# Altium schematic sheet LoraSTM32.SchDoc
size 420 x 297 mm; Scale: 1:1; Разраб.: Иванов; Обозначение документа: АБВГ.123456.001 Э3; Пров.: Петров; Утв.: Сидоров; Наименование организации: ОАО "Ваша фирма"; Перв. применение: АБВГ.123456.000; Наименование изделия 1: Плата; Наименование изделия 2: Схема электрическая; Наименование изделия 3: принципиальная; Нач. отд.: Нач. отд.; Фамилия нач. отд.: Сидоров
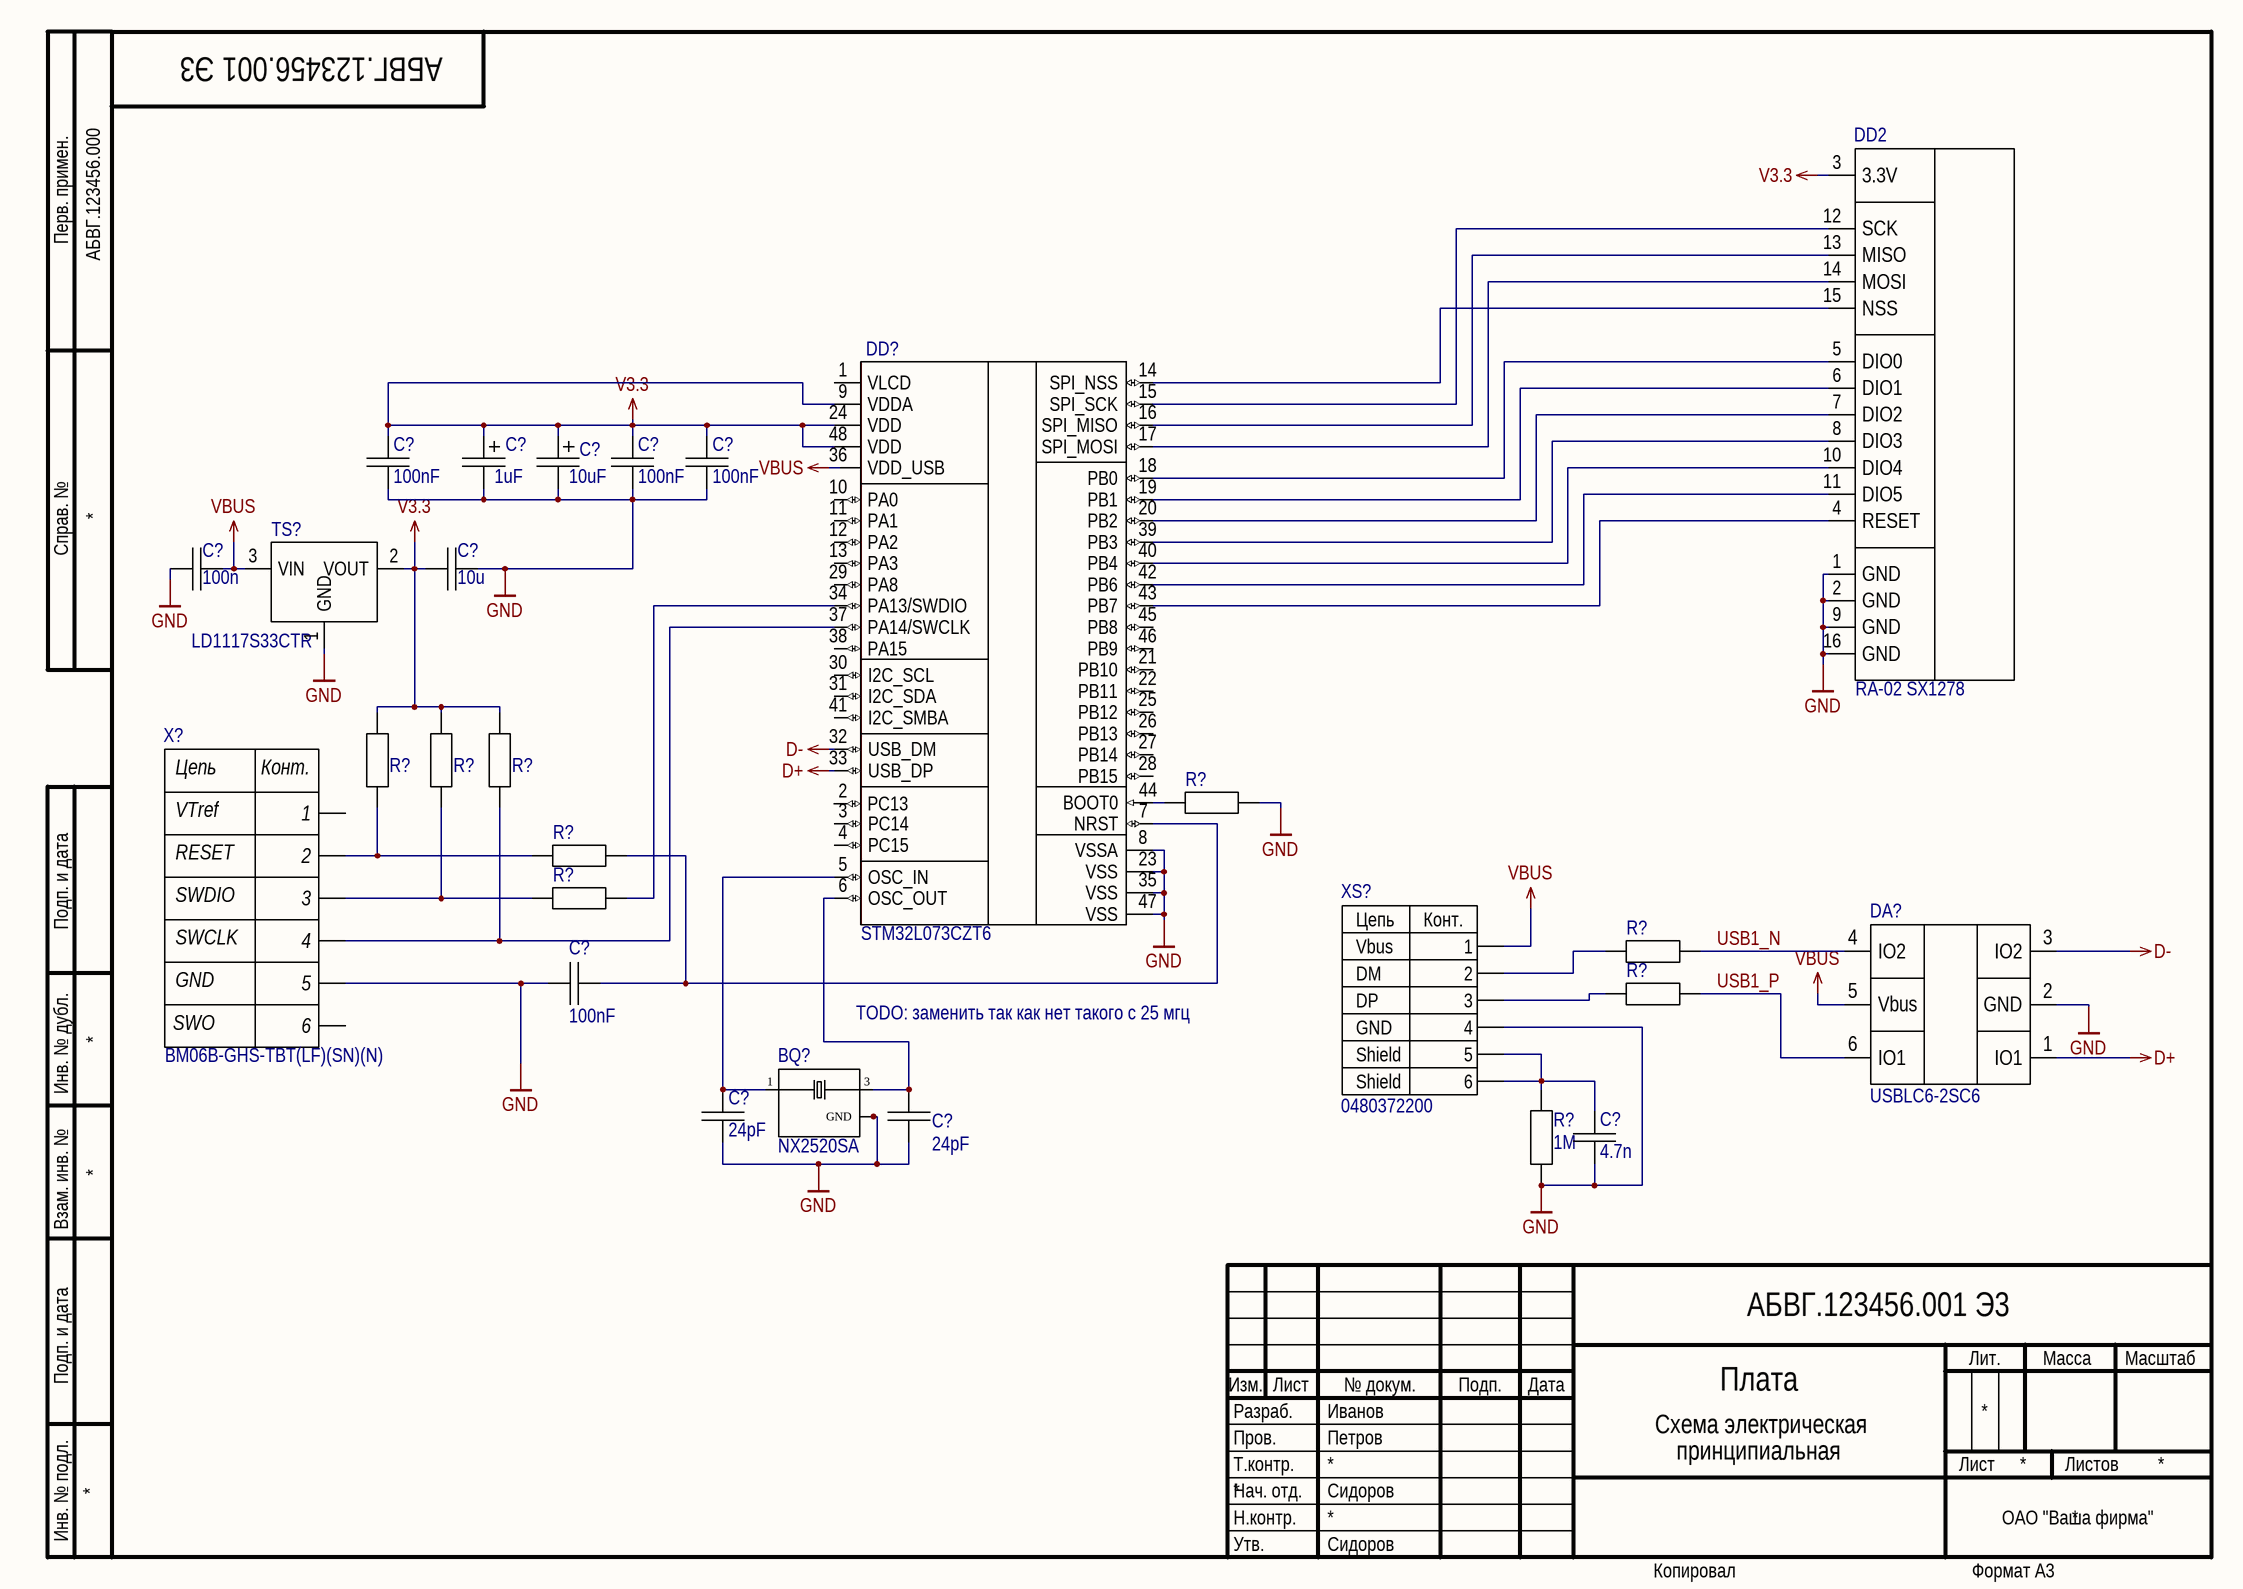
[diagram p0: LoraSTM32.SchDoc]

## Parts
(Parts that share a designator on the sheet are numbered #1, #2 ... from top to bottom, then left to right.)
BQ?  NX2520SA  [*XTAL_NX2520SA-24.000000MHZ-B8]
C?#1  GRM21BR71C105KA01L: 100nF  [CAPC1608X09L]  (hidden comment: *)
C?#2  value 1uF  [CAPMP3216X16N-A]  (hidden comment: *)
C?#3  value 10uF  [CAPMP3216X16N-A]  (hidden comment: *)
C?#4  GRM21BR71C105KA01L: 100nF  [CAPC1608X09L]  (hidden comment: *)
C?#5  GRM21BR71C105KA01L: 100nF  [CAPC1608X09L]  (hidden comment: *)
C?#6  GRM21BR71C105KA01L: 100n  [Murata_GRM121_IPC_B]  (hidden comment: *)
C?#7  GRM21BR71C105KA01L: 10u  [Murata_GRM121_IPC_B]  (hidden comment: *)
C?#8  value 100nF  [CAPC0603X02N]  (hidden comment: CC0603)
C?#9  GRM1885C1H240JA01D: 24pF  [CAPC1608X09L]  (hidden comment: *)
C?#10  GRM1885C1H240JA01D: 24pF  [CAPC1608X09L]  (hidden comment: *)
C?#11  value 4.7n  [CAPC1608X09L]  (hidden comment: *)
DA?  USBLC6-2SC6  [SOT95P280X145-6N]
DD2  RA-02 SX1278  [RA-02]
DD?  STM32L073CZT6  [*QFP50P900X900X160-48N]
R?#1  R1608  [RESC1608X05N]  (value not drawn)
R?#2  R1608  [RESC1608X05N]  (value not drawn)
R?#3  R1608  [RESC1608X05N]  (value not drawn)
R?#4  R1608  [RESC1608X05N]  (value not drawn)
R?#5  R1608  [RESC1608X05N]  (value not drawn)
R?#6  R1608  [RESC1608X05N]  (value not drawn)
R?#7  R1608  [RESC1608X05N]  (value not drawn)
R?#8  R1608  [RESC1608X05N]  (value not drawn)
R?#9  value 1M  [RESC1608X05N]  (hidden comment: R1608)
TS?  LD1117S33CTR  [SOT-23-TT3_M]
X?  BM06B-GHS-TBT(LF)(SN)(N)  [BM06B-GH]
XS?  Part Number: 0480372200  [Molex_0480372200_0]  (hidden comment: Conn_Molex_0480372200_eec)

## Nets
D+: DA?.1(IO1) DD?.33(USB_DP)
D-: DA?.3(IO2) DD?.32(USB_DM)
GND: BQ?.2(GND) BQ?.4(GND) C?#1.2 C?#2.2 C?#3.2 C?#4.2 C?#5.2 C?#6.2 C?#7.1 C?#8.1 C?#9.1 C?#10.1 C?#11.1 DA?.2(GND) DD2.1(GND) DD2.2(GND) DD2.9(GND) DD2.16(GND) DD?.8(VSSA) DD?.23(VSS) DD?.35(VSS) DD?.47(VSS) R?#4.1 R?#9.2 TS?.1(GND) X?.5 XS?.4
V3.3: C?#1.1 C?#2.1 C?#3.1 C?#4.1 C?#5.1 C?#7.2 DD2.3(3.3V) DD?.9(VDDA) DD?.24(VDD) DD?.48(VDD) R?#1.1 R?#2.1 R?#3.1 TS?.2(VOUT)
VBUS: C?#6.1 DA?.5(Vbus) DD?.36(VDD_USB) TS?.3(VIN) XS?.1
USB1_N: DA?.4(IO2) R?#7.1
USB1_P: DA?.6(IO1) R?#8.1
NetBQ?_1: BQ?.1 C?#9.2 DD?.5(OSC_IN)
NetBQ?_3: BQ?.3 C?#10.2 DD?.6(OSC_OUT)
NetC?#8_2: C?#8.2 DD?.7(NRST) R?#5.1
NetC?#11_2: C?#11.2 R?#9.1 XS?.5(MNT_1) XS?.6(MNT_2)
NetDD2_4: DD2.4(RESET) DD?.43(PB7)
NetDD2_5: DD2.5(DIO0) DD?.18(PB0)
NetDD2_6: DD2.6(DIO1) DD?.19(PB1)
NetDD2_7: DD2.7(DIO2) DD?.20(PB2)
NetDD2_8: DD2.8(DIO3) DD?.39(PB3)
NetDD2_10: DD2.10(DIO4) DD?.40(PB4)
NetDD2_11: DD2.11(DIO5) DD?.42(PB6)
NetDD2_12: DD2.12(SCK) DD?.15(SPI_SCK)
NetDD2_13: DD2.13(MISO) DD?.16(SPI_MISO)
NetDD2_14: DD2.14(MOSI) DD?.17(SPI_MOSI)
NetDD2_15: DD2.15(NSS) DD?.14(SPI_NSS)
NetDD?_34: DD?.34(PA13/SWDIO) R?#6.1
NetDD?_37: DD?.37(PA14/SWCLK) R?#3.2 X?.4
NetDD?_44: DD?.44(BOOT0) R?#4.2
NetR?#1_2: R?#1.2 R?#5.2 X?.2
NetR?#2_2: R?#2.2 R?#6.2 X?.3
NetR?#7_2: R?#7.2 XS?.2
NetR?#8_2: R?#8.2 XS?.3

Not connected (* = marked no-connect by the designer): DD? 1(VLCD) 2(PC13) 3(PC14) 4(PC15) 10(PA0) 11(PA1) 12(PA2) 13(PA3) 21(PB10) 22(PB11) 25(PB12) 26(PB13) 27(PB14) 28(PB15) 29(PA8) 30(I2C_SCL) 31(I2C_SDA) 38(PA15) 41(I2C_SMBA) 45(PB8) 46(PB9); X? 1 6

## Notes on the sheet
- TODO: заменить так как нет такого с 25 мгц
- Перв. примен.
- Справ. №
- Подп. и дата
- Инв. № дубл.
- Взам. инв. №
- Разраб.
- Изм.
- Лист
- № докум.
- Подп.
- Дата
- Лит.
- Масса
- Масштаб
- Пров.
- Т.контр.
- Листов
- Инв. № подл.
- Утв.
- Н.контр.
- Копировал
- Формат А3
- (in symbol Conn_Molex_0480372200_eec) Цепь; Конт.; Vbus; DM; DP; GND; Shield
- (in symbol Разъем SWD) Цепь; Конт.; VTref; RESET; SWDIO; SWCLK; GND; SWO

## Library data of the parts
BQ? = NX2520SA-24.000000MHZ-B8: CRYSTAL 24.0000MHZ 10PF SMD; MF: NDK America, Inc.; Package: SMD-4 NDK America, Inc.; MP: NX2520SA-24.000000MHZ-B8; Availability: Unavailable; SnapEDA_Link: https://www.snapeda.com/parts/NX2520SA-24.000000MHZ-B8/NDK%20America%2C%20Inc./view-part/?ref=snap; Price: None; Value: *
C?#1 C?#4-C?#7 C?#9 C?#10 = CC1608: Конденсатор 1.6x0.8 мм; Tolerance: ±10%; ТКЕ: X7R; РКД Наименование: CC1608M - NP0 - 16 V - 10 nF ±10%; Voltage: *; Type: *; PartNo: *; Supplier Part Number 1: *; Supplier 1: *
C?#2 C?#3 = CT3216-A: Tantalum Surface Mount Capacitor, Size A; Voltage: 6.3V; Type: *; PartNo: *; Supplier Part Number 1: *; Supplier 1: *
C?#8 = CC0603: Конденсатор 0.6х0.3 мм; Voltage: *; Type: *; PartNo: *; Supplier Part Number 1: *; Supplier 1: *; РКД Наименование: *
C?#11 = CC1608: Конденсатор 1.6x0.8 мм; Tolerance: ±10%; ТКЕ: X7R; РКД Наименование: CC1608M - NP0 - 16 V - 4.7 nF ±10%; Voltage: *; Type: *; PartNo: *; Supplier Part Number 1: *; Supplier 1: *
DA? = USBLC6-2SC6: USB protection IC; Manufacturer: STMicroelectronics; Direction: Bidirectional,Unidirectional; Capacitance: 3.5pF; Clamping Voltage: 17V; Operating Supply Voltage: 1.1V; Number of Channels: 2; Breakdown Voltage: 6V; Reverse Standoff Voltage: 5.25V; Power Line Protection: Yes; Test Current: 1mA; Max Reverse Leakage Current: 150nA; Peak Pulse Current: 5A; Element Configuration: Dual; Data Rate: 480Mbps; Number of Elements: 1; Working Voltage: 5V; PartNo: USBLC6-2SC6; Supplier 1: Digi-Key; Manufacturer Part Number: USBLC6-2SC6; Stock 1: 165611; Pricing 1: 1=0.49, 10=0.419, 100=0.3131, 500=0.24602, 1000=0.1901 (USD); Mount: Surface Mount; Case/Package: SOT-23; Number of Pins: 6; Contact Plating: Matte,Tin; Min Operating Temperature: -40°C; Max Operating Temperature: 125°C; Packaging: Tape and Reel; Package Quantity: 3000; Termination: SMD/SMT; Number of Bidirectional Channels: 2; Min Breakdown Voltage: 6V; ESD Protection: Yes; Leakage Current: 150nA; Reverse Breakdown Voltage: 6V; Polarity: Bidirectional,Unidirectional; Max Breakdown Voltage: 6V; Length: 3.05mm; Height: 1.3mm; Width: 1.75mm; Depth: 1.75mm; Radiation Hardening: No; REACH SVHC: No SVHC; Lead Free: Lead Free; ComponentLink1URL: http://www.farnell.com/datasheets/1690354.pdf; ComponentLink1Description: http://www.farnell.com/datasheets/1690354.pdf; ComponentLink2URL: http://www.st.com/content/ccc/resource/technical/document/datasheet/06/1d/48/9c/6c/20/4a/b2/CD00050750.pdf/files/CD00050750.pdf/jcr:content/translations/en.CD00050750.pdf; ComponentLink2Description: http://www.st.com/content/ccc/resource/technical/document/datasheet/06/1d/48/9c/6c/20/4a/b2/CD00050750.pdf/files/CD00050750.pdf/jcr:content/translations/en.CD00050750.pdf; ComponentLink3URL: http://www.st.com/web/en/resource/technical/document/datasheet/CD00050750.pdf; ComponentLink3Description: http://www.st.com/web/en/resource/technical/document/datasheet/CD00050750.pdf; ComponentLink4URL: http://datasheet.iiic.cc/stmicroelectronics/USBLC6-2SC6.pdf; ComponentLink4Description: http://datasheet.iiic.cc/stmicroelectronics/USBLC6-2SC6.pdf; ComponentLink5URL: http://www.produktinfo.conrad.com/datenblaetter/1100000-1199999/001184109-da-01-en-IC_ESD_PROTECTI_USBLC6_2SC6_SOT_23_6_STM.pdf; ComponentLink5Description: http://www.produktinfo.conrad.com/datenblaetter/1100000-1199999/001184109-da-01-en-IC_ESD_PROTECTI_USBLC6_2SC6_SOT_23_6_STM.pdf; Supplier Part Number 1: 497-5235-1-ND
DD2 = RA-02
DD? = STM32L073CZT6: / ARMВ® CortexВ®-M0+ STM32 L0 Microcontroller IC 32-Bit 32MHz 192KB _192K x 8_ FLASH 48-LQFP /; MF: STMicroelectronics; SnapEDA_Link: https://www.snapeda.com/parts/STM32L073CZT6/STMicroelectronics/view-part/?ref=snap; Digi-Key_Purchase_URL: https://www.digikey.com/product-detail/en/stmicroelectronics/STM32L073CZT6/497-17506-ND/8024098?utm_source=snapeda&utm_medium=aggregator&utm_campaign=symbol; MP: STM32L073CZT6; Package: LQFP-48 STMicroelectronics; Digi-Key_Part_Number: 497-17506-ND; Value: *
R?#1-R?#3 = R1608: Резистор 1.6x0.8 мм; Tolerance: ±1%; РКД Наименование: RC1608M - 22 Ohm ±1%; Value: 10k; Type: *; PartNo: *; Supplier 1: *; Supplier Part Number 1: *
R?#4-R?#8 = R1608: Резистор 1.6x0.8 мм; Tolerance: ±1%; РКД Наименование: RC1608M - 22 Ohm ±1%; Value: 22; Type: *; PartNo: *; Supplier 1: *; Supplier Part Number 1: *
R?#9 = R1608: Резистор 1.6x0.8 мм; Manufacturer Part Number: RC0603JR-071ML; Tolerance: ±5%; РКД Наименование: RC1608M - 1 MOhm ±5%; Type: *; PartNo: *; Supplier 1: *; Supplier Part Number 1: 311-1.0MGRCT-ND
TS? = MCP1700T-3302E/TT: Low Quiescent Current LDO, 3-Pin SOT-23, Extended Temperature, Tape and Reel; Code_IPC: SOT23-3; PackageVersion: revBB, Aug-2009; PackageReference: SOT-23-TT3; PackageDescription: 3-Lead Plastic Small Outline Transistor (TT) [SOT-23]; DatasheetVersion: revB, Feb-2007; PartNumber: MCP1700T-3302E/TT
X? = Разъем SWD: SWD отладка; Manufacturer: JST; Max Current Rating: 1A; Contact Resistance: 50mR; Number of Positions: 6; Max Voltage Rating (AC): 50V; Connector Type: Outer Shroud Contact; Pitch: 0.049inch; PartNo: BM06B-GHS-TBT(LF)(SN)(N); Supplier 1: Digi-Key; Supplier Part Number 1: 455-1582-1-ND; Manufacturer Part Number: BM06B-GHS-TBT(LF)(SN)(N); Stock 1: 44065; Pricing 1: 1=0.56, 10=0.524, 100=0.4019, 500=0.34948, 1000=0.28832 (USD); Mount: Surface Mount; Colour: Natural; Contact Plating: Copper,Tin; Contact Material: Bronze; Housing Colour: Beige; Housing Material: Polyamide; Min Operating Temperature: -25°C; Max Operating Temperature: 85°C; Number of Rows: 1; Fastening Type: Ramp; Packaging: Tape and Reel; Termination: Solder; Orientation: Straight; Length: 10.75mm; Depth: 4.25mm; Lead Free: Lead Free; ComponentLink1URL: http://www.jst-mfg.com/product/pdf/eng/eGH.pdf; ComponentLink1Description: http://www.jst-mfg.com/product/pdf/eng/eGH.pdf
XS? = Conn_Molex_0480372200_eec: CONN PLUG USB A 4POS SMD R/A; Manufacturer: Molex; Is Female: yes; Current - Maximum per Contact: 1.5A; Voltage - Maximum: 150V AC (RMS); helpURL: https://upverter.com/upn/revision/6bade1e906f93a88/; ComponentLink2Description: Datasheet; Temperature: -20°C to +85°C; Package: CONN_USB_12MM0_18MM75; Supplier 2: Mouser; Price: 0.972849437621; Supplier 1: Digi-Key; ComponentLink1URL: https://upverter.com/upn/revision/6bade1e906f93a88/; Supplier Part Number 2: 538-48037-2200; Supplier Part Number 1: WM3983CT-ND; ComponentLink1Description: Upverter; ComponentLink2URL: http://www.molex.com/pdm_docs/sd/480372200_sd.pdf; RoHS: TRUE; Mouser Part Number: 538-48037-2200; Temperature Range High: +85°C; Digikey Description: CONN PLUG USB A 4POS SMD R/A; Digikey Part Number: WM3983CT-ND; Lead Free: yes; Temperature Range Low: -20°C